# EAGLE design midi-switcher-smt (EAGLE 6.6.0)
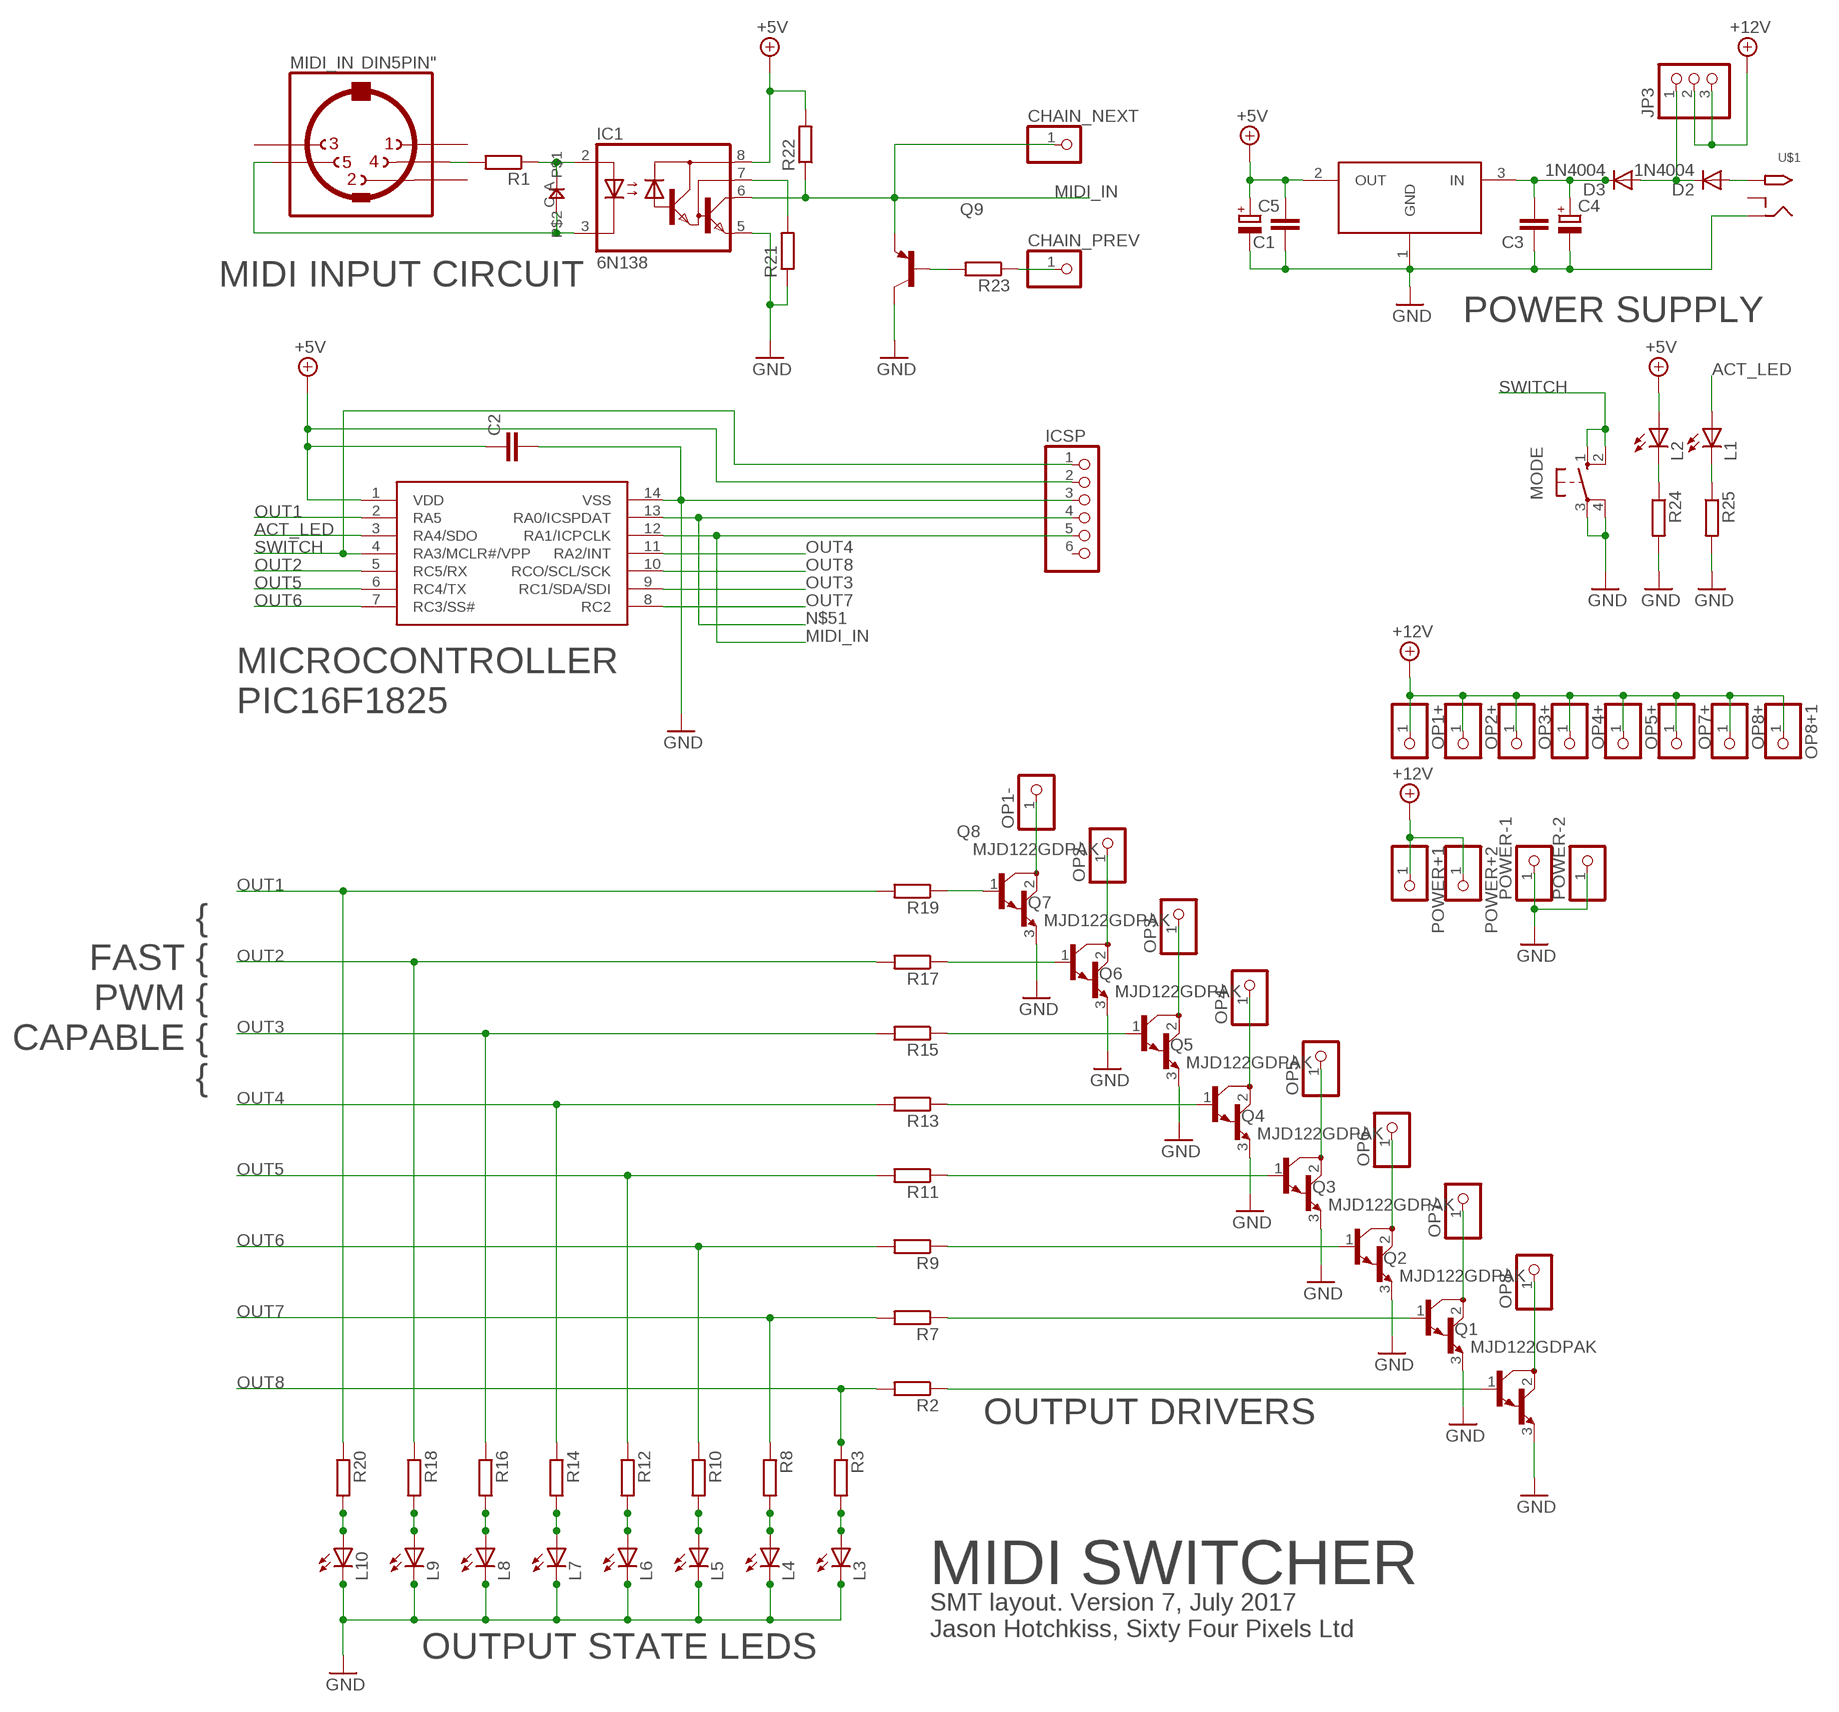
[diagram p0: schematic, sheet 1]

## Parts
C1  C-EUC0805  [C0805]
C2  C-EUC0805  [C0805]
C3  C-EUC0805  [C0805]
C4  CPOL-EUE2.5-7  [E2,5-7]
C5  CPOL-EUE2.5-6  [E2,5-6]
CHAIN_NEXT  PINHD-1X1  [1X01]
CHAIN_PREV  PINHD-1X1  [1X01]
D1  0805DIODE  [0805DIODE]
D2  1N4004  [DO-VERT]
D3  1N4004  [DO-VERT]
IC1  6N138  [DIL08]
IC2  PIC16F1825SO14  [SO14]
IC3  LD1086  [DPACK]
ICSP  HEADER-1X6  [1X06_OVAL]
JP3  PINHD-1X3  [1X03]
L1  LEDCHIP-LED0805  [CHIP-LED0805]
L2  LEDCHIP-LED0805  [CHIP-LED0805]
L3  LEDCHIP-LED0805  [CHIP-LED0805]
L4  LEDCHIP-LED0805  [CHIP-LED0805]
L5  LEDCHIP-LED0805  [CHIP-LED0805]
L6  LEDCHIP-LED0805  [CHIP-LED0805]
L7  LEDCHIP-LED0805  [CHIP-LED0805]
L8  LEDCHIP-LED0805  [CHIP-LED0805]
L9  LEDCHIP-LED0805  [CHIP-LED0805]
L10  LEDCHIP-LED0805  [CHIP-LED0805]
MIDI_IN  DIN5PIN"  [TRUCONN90]
MODE  10-XX  [B3F-10XX]
OP1+  PINHD-1X1  [1X01W]
OP1-  PINHD-1X1  [1X01W]
OP2+  PINHD-1X1  [1X01W]
OP2-  PINHD-1X1  [1X01W]
OP3+  PINHD-1X1  [1X01W]
OP3-  PINHD-1X1  [1X01W]
OP4+  PINHD-1X1  [1X01W]
OP4-  PINHD-1X1  [1X01W]
OP5+  PINHD-1X1  [1X01W]
OP5-  PINHD-1X1  [1X01W]
OP6-  PINHD-1X1  [1X01W]
OP7+  PINHD-1X1  [1X01W]
OP7-  PINHD-1X1  [1X01W]
OP8+  PINHD-1X1  [1X01W]
OP8+1  PINHD-1X1  [1X01W]
OP8-  PINHD-1X1  [1X01W]
POWER+1  PINHD-1X1  [1X01W]
POWER+2  PINHD-1X1  [1X01W]
POWER-1  PINHD-1X1  [1X01W]
POWER-2  PINHD-1X1  [1X01W]
Q1  MJD122GDPAK  [DPACK]
Q2  MJD122GDPAK  [DPACK]
Q3  MJD122GDPAK  [DPACK]
Q4  MJD122GDPAK  [DPACK]
Q5  MJD122GDPAK  [DPACK]
Q6  MJD122GDPAK  [DPACK]
Q7  MJD122GDPAK  [DPACK]
Q8  MJD122GDPAK  [DPACK]
Q9  MMBT3906LT1-PNP-SOT23-BEC  [SOT23-BEC]
R1  R-EU_R0805  [R0805]
R2  R-EU_R0805  [R0805]
R3  R-EU_R0805  [R0805]
R7  R-EU_R0805  [R0805]
R8  R-EU_R0805  [R0805]
R9  R-EU_R0805  [R0805]
R10  R-EU_R0805  [R0805]
R11  R-EU_R0805  [R0805]
R12  R-EU_R0805  [R0805]
R13  R-EU_R0805  [R0805]
R14  R-EU_R0805  [R0805]
R15  R-EU_R0805  [R0805]
R16  R-EU_R0805  [R0805]
R17  R-EU_R0805  [R0805]
R18  R-EU_R0805  [R0805]
R19  R-EU_R0805  [R0805]
R20  R-EU_R0805  [R0805]
R21  R-EU_R0805  [R0805]
R22  R-EU_R0805  [R0805]
R23  R-EU_R0805  [R0805]
R24  R-EU_R0805  [R0805]
R25  R-EU_R0805  [R0805]
U$1  2.1MMJACKTHM  [PJ-102A]

## Nets
+5V: C1.2 C2.1 C5.+ IC1.8(VCC) IC2.1(VDD) IC3.2(OUT) ICSP.2 L2.A R22.2
+12V: JP3.2 JP3.3 OP1+.1 OP2+.1 OP3+.1 OP4+.1 OP5+.1 OP7+.1 OP8+1.1 OP8+.1 POWER+1.1 POWER+2.1
ACT_LED: IC2.3(RA4/SDO) L1.A
GND: C1.1 C2.2 C3.1 C4.- C5.- IC1.5(GND) IC2.14(VSS) IC3.1(GND) ICSP.3 L3.C L4.C L5.C L6.C L7.C L8.C L9.C L10.C MODE.3(P) MODE.4(P1) POWER-1.1 POWER-2.1 Q1.3(E) Q2.3(E) Q3.3(E) Q4.3(E) Q5.3(E) Q6.3(E) Q7.3(E) Q8.3(E) Q9.C R21.1 R24.2 R25.2 U$1.RING
MIDI_IN: CHAIN_NEXT.1 IC1.6(VO) IC2.12(RA1/ICPCLK) ICSP.5 Q9.E R22.1
N$1: D1.C IC1.3(C) MIDI_IN.5
N$2: MIDI_IN.4 R1.2
N$3: D1.A IC1.2(A) R1.1
N$4: IC1.7(VB) R21.2
N$5: L1.C R25.1
N$6: L10.A R20.2
N$7: L9.A R18.2
N$8: Q8.1(B) R19.1
N$9: Q7.1(B) R17.1
N$10: Q6.1(B) R15.1
N$11: Q5.1(B) R13.1
N$12: Q4.1(B) R11.1
N$13: Q3.1(B) R9.1
N$14: Q2.1(B) R7.1
N$15: Q1.1(B) R2.1
N$16: Q9.B R23.2
N$18: CHAIN_PREV.1 R23.1
N$24: L8.A R16.2
N$25: OP1-.1 Q8.2(C)
N$26: OP2-.1 Q7.2(C)
N$27: OP3-.1 Q6.2(C)
N$28: L2.C R24.1
N$29: OP5-.1 Q4.2(C)
N$30: OP6-.1 Q3.2(C)
N$31: OP4-.1 Q5.2(C)
N$33: L7.A R14.2
N$35: L6.A R12.2
N$36: L5.A R10.2
N$37: L4.A R8.2
N$38: L3.A R3.2
N$39: C3.2 C4.+ D3.C IC3.3(IN)
N$42: OP7-.1 Q2.2(C)
N$43: D2.A U$1.TIP
N$47: OP8-.1 Q1.2(C)
N$51: IC2.13(RA0/ICSPDAT) ICSP.4
N$54: D2.C D3.A JP3.1
OUT1: IC2.2(RA5) R19.2 R20.1
OUT2: IC2.5(RC5/RX) R17.2 R18.1
OUT3: IC2.9(RC1/SDA/SDI) R15.2 R16.1
OUT4: IC2.11(RA2/INT) R13.2 R14.1
OUT5: IC2.6(RC4/TX) R11.2 R12.1
OUT6: IC2.7(RC3/SS#) R9.2 R10.1
OUT7: IC2.8(RC2) R7.2 R8.1
OUT8: IC2.10(RCO/SCL/SCK) R2.2 R3.1
SWITCH: IC2.4(RA3/MCLR#/VPP) ICSP.1 MODE.1(S) MODE.2(S1)
Unconnected: ICSP.6 MIDI_IN.1 MIDI_IN.2 MIDI_IN.3 U$1.RING_SW

## Notes on the sheet
- MIDI INPUT CIRCUIT
- POWER SUPPLY
- MICROCONTROLLER 
  PIC16F1825
- {
  FAST {
  PWM {
  CAPABLE {
  {
- OUTPUT DRIVERS
- MIDI SWITCHER
- SMT layout. Version 7, July 2017
  Jason Hotchkiss, Sixty Four Pixels Ltd
- OUTPUT STATE LEDS

## Library data of the parts
C1-C3 = rcl:C-EU: CAPACITOR, European symbol
C4 C5 = rcl:CPOL-EU: POLARIZED CAPACITOR, European symbol
CHAIN_NEXT CHAIN_PREV = adafruit:PINHD-1X1: Pin header 1x1 for 0.1" spacing With round pins
D1 = jasons_stuff:0805DIODE
D2 D3 = jasons_stuff:1N4004: DIODE general purpose rectifier, 1 A
IC1 = optocoupler:6N138: MOTOROLA OPTO COUPLER
IC2 = jasons_stuff:PIC16F1825
IC3 = jason_eagle6:LD1086
ICSP = microbuilder:HEADER-1X6: PIN HEADER
JP3 = pinhead:PINHD-1X3: PIN HEADER
L1-L10 = led:LED: LED OSRAM: - CHIPLED LG R971, LG N971, LY N971, LG Q971, LY Q971, LO R971, LY R971 LH N974, LH R974 LS Q976, LO Q976, LY Q976 LO Q996 - Hyper CHIPLED LW Q18S LB Q993, LB Q99A, LB R99A - SideLED LS A670, LO A670, LY A670, LG A670, LP A670 LB A673, LV A673, LT A673, LW A673 LH A674 LY A675 LS A676, LA A676, LO A676, LY A676, LW A676 LS A679, LY A679, LG A679 - Hyper Micro SIDELED® LS Y876, LA Y876, LO Y876, LY Y876 LT Y87S - SmartLED LW L88C, LW L88S LB L89C, LB L89S, LG L890 LS L89K, LO L89K, LY L89K LS L896, LA L896, LO L896, LY L896 - TOPLED LS T670, LO T670, LY T670, LG T670, LP T670 LSG T670, LSP T670, LSY T670, LOP T670, LYG T670 LG T671, LOG T671, LSG T671 LB T673, LV T673, LT T673, LW T673 LH T674 LS T676, LA T676, LO T676, LY T676, LB T676, LH T676, LSB T676, LW T676 LB T67C, LV T67C, LT T67C, LS T67K, LO T67K, LY T67K, LW E67C LS E67B, LA E67B, LO E67B, LY E67B, LB E67C, LV E67C, LT E67C LW T67C LS T679, LY T679, LG T679 LS T770, LO T770, LY T770, LG T770, LP T770 LB T773, LV T773, LT T773, LW T773 LH T774 LS E675, LA E675, LY E675, LS T675 LS T776, LA T776, LO T776, LY T776, LB T776 LHGB T686 LT T68C, LB T68C - Hyper Mini TOPLED® LB M676 - Mini TOPLED Santana® LG M470 LS M47K, LO M47K, LY M47K Source: http://www.osram.convergy.de LUXEON: - LUMILED® LXK2-PW12-R00, LXK2-PW12-S00, LXK2-PW14-U00, LXK2-PW14-V00 LXK2-PM12-R00, LXK2-PM12-S00, LXK2-PM14-U00 LXK2-PE12-Q00, LXK2-PE12-R00, LXK2-PE12-S00, LXK2-PE14-T00, LXK2-PE14-U00 LXK2-PB12-K00, LXK2-PB12-L00, LXK2-PB12-M00, LXK2-PB14-N00, LXK2-PB14-P00, LXK2-PB14-Q00 LXK2-PR12-L00, LXK2-PR12-M00, LXK2-PR14-Q00, LXK2-PR14-R00 LXK2-PD12-Q00, LXK2-PD12-R00, LXK2-PD12-S00 LXK2-PH12-R00, LXK2-PH12-S00 LXK2-PL12-P00, LXK2-PL12-Q00, LXK2-PL12-R00 Source: www.luxeon.com KINGBRIGHT: KA-3528ASYC Source: www.kingbright.com
MIDI_IN = jasons_stuff:DIN5PIN: Female CONNECTOR 5 pins 90 deg. with shield, horizontal (DIN 41524)
MODE = switch-omron:10-XX: OMRON SWITCH
OP1+ OP1- OP2+ OP2- OP3+ OP3- OP4+ OP4- OP5+ OP5- OP6- OP7+ OP7- OP8+ OP8+1 OP8- POWER+1 POWER+2 POWER-1 POWER-2 = jason_eagle6:PINHD-1X1: PIN HEADER
Q1-Q8 = jason_eagle6:MJD122G: NPN Darlington Transistor
Q9 = transistor:*-PNP-: PNP Transistror
R1-R3 R7-R25 = rcl:R-EU_: RESISTOR, European symbol
U$1 = adafruit:2.1MMJACK: 2.1mm x 5.5mm THM DC jack with internal switch. Digikey part #PJ-102A, 4UCON part #05537 2.1mm x 5.5mm SMT DC jack with internal switch. Digikey part #PJ-002A-SMT, 4UCON part #03267 By microbuilder.eu & adafruit.com

## Board
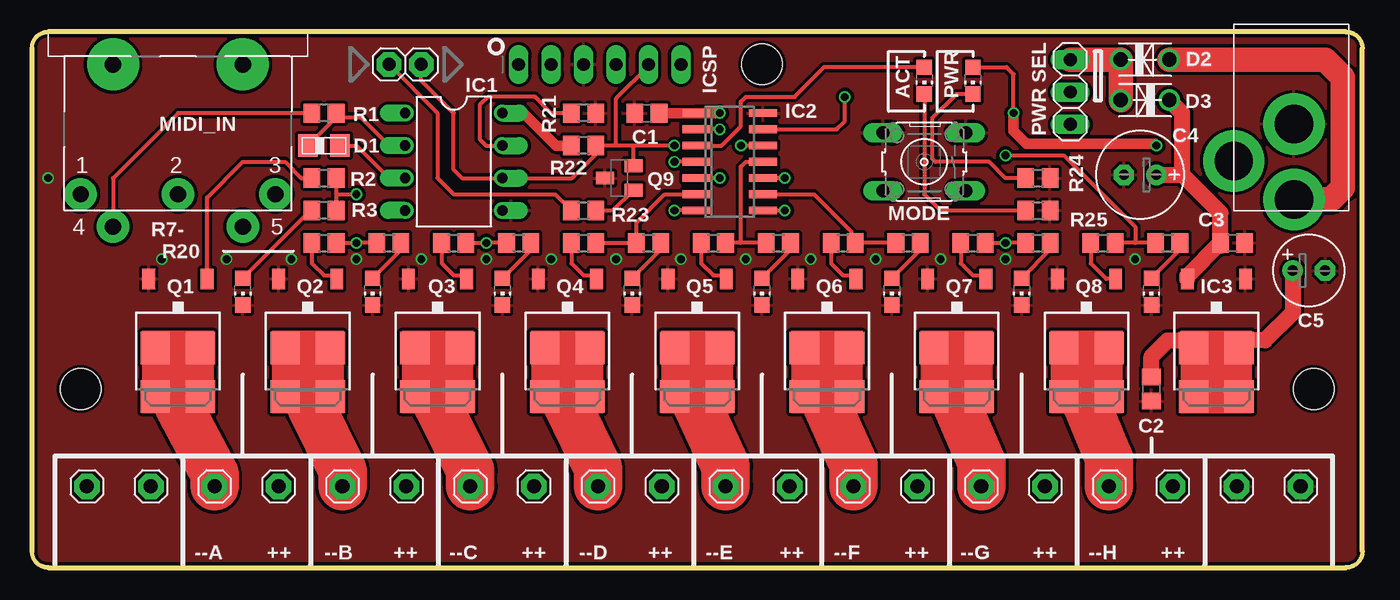
[diagram p1: board, top side]
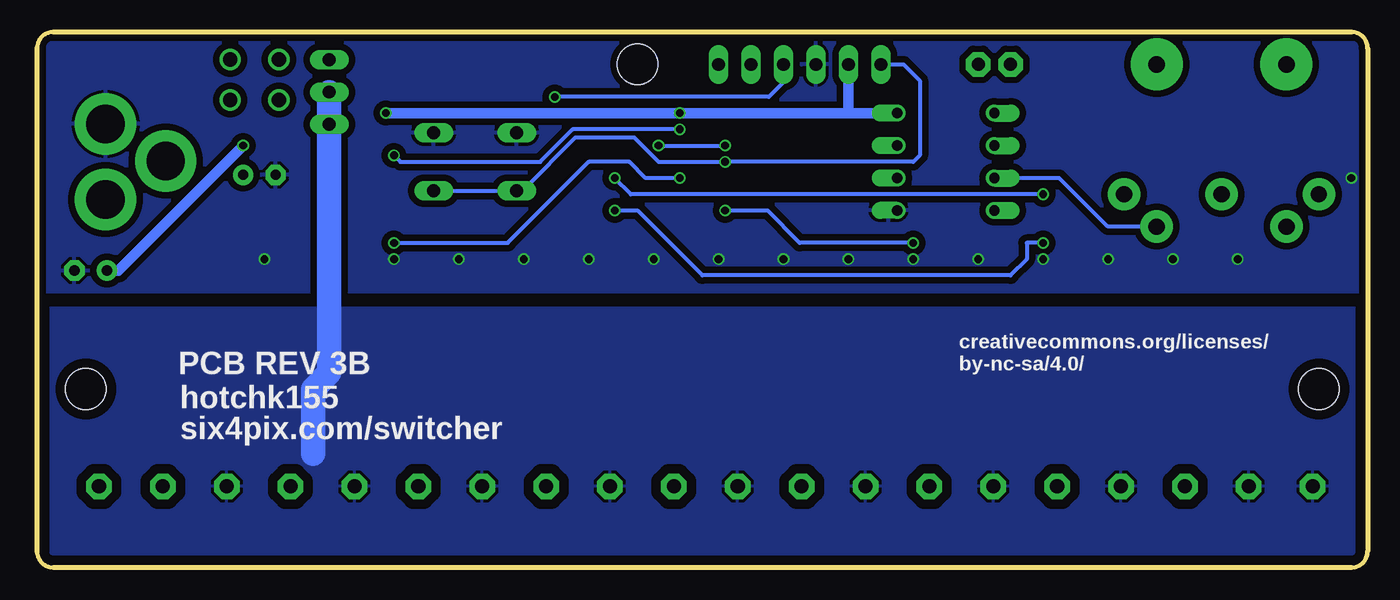
[diagram p2: board, bottom side, seen from below]

Size 104.14 x 41.91 mm. Coordinates in mm from the lower left corner, seen from the top.
Outline: 1.27,0 102.87,0 arc90 104.14,1.27 104.14,40.64 arc90 102.87,41.91 1.27,41.91 arc90 0,40.64 0,1.27 arc90 1.27,0
Copper layers (1*16): Top 0.035mm / dielectric 1.5mm / Bottom 0.035mm
Design rules "ITEADstudio_DRC": minimum track width 6mil, minimum drill 12mil, track to track 6mil, track to pad 6mil, pad to pad 6mil, via to via 6mil, smd to smd 0mil, copper to edge 10mil, drill to drill 10mil, minimum pad ring 10mil, minimum via ring 6mil, stop-mask expansion 2mil, vias tented up to drill 100mil, thermal gap 10mil
Holes 3.2 mm at 3.81,13.97 100.33,13.97 57.15,39.37

### Footprints (pad centres in the part's own frame; a part is rotated, then mirrored left to right if it is on the bottom)
C0805 = smd 1.3 x 1.5: 1 -0.95,0; 2 0.95,0
E2,5-7 = drill 0.813 pad 1.6: + -1.27,0 | drill 0.813 pad 1.6 octagon: - 1.27,0
E2,5-6 = drill 0.813 pad 1.6: + -1.27,0 | drill 0.813 pad 1.6 octagon: - 1.27,0
1X01 = drill 1.016 pad 1.93 octagon: 1 0,0
0805DIODE = smd 1.524 x 1.778: A -1.262,-0.005; C 1.238,-0.005
DO-VERT = drill 1.118: A 2.54,0; C -1.27,0
DIL08 = drill 0.813 offset: 1 -3.81,-3.81; 2 -1.27,-3.81; 3 1.27,-3.81; 4 3.81,-3.81; 5 3.81,3.81; 6 1.27,3.81; 7 -1.27,3.81; 8 -3.81,3.81
SO14 = smd 0.6 x 2.2: 1 -3.81,-2.6; 2 -2.54,-2.6; 3 -1.27,-2.6; 4 0,-2.6; 5 1.27,-2.6; 6 2.54,-2.6; 7 3.81,-2.6; 8 3.81,2.6; 9 2.54,2.6; 10 1.27,2.6; 11 0,2.6; 12 -1.27,2.6; 13 -2.54,2.6; 14 -3.81,2.6
DPACK = smd 1 x 1.6: 1 -2.28,-4.8; 3 2.28,-4.8 | smd 2.286 x 2.54: 2 -1.778,4.405; 4 1.778,4.405; 5 -1.778,0.595; 6 1.778,0.595
1X06_OVAL = drill 1 long: 1 -6.35,0; 2 -3.81,0; 3 -1.27,0; 4 1.27,0; 5 3.81,0; 6 6.35,0
1X03 = drill 1.016 long: 1 -2.54,0; 2 0,0; 3 2.54,0
CHIP-LED0805 = smd 1.2 x 1.2: A 0,-1.05; C 0,1.05
TRUCONN90 = drill 1.27 pad 2.54: 1 7.62,5.08; 2 0,5.08; 3 -7.62,5.08; 4 5.08,7.62; 5 -5.08,7.62 | drill 1.27 pad 4.064: NC -5.08,-5.08; NC@ 5.08,-5.08
B3F-10XX = drill 1.016 long: 1 -3.251,2.261; 2 3.251,2.261; 3 -3.251,-2.261; 4 3.251,-2.261
1X01W = drill 1.1 pad 2 octagon: 1 0,0
SOT23-BEC = smd 1 x 1.4: B -0.95,-1.1; C 0,1.1; E 0.95,-1.1
R0805 = smd 1.3 x 1.5: 1 -0.95,0; 2 0.95,0
PJ-102A = drill 3 pad 4.8: RING 0.1,-3.39; RING_SW -4.6,-6.29; TIP 0.1,-9.29

### Placement (x,y rotation side)
C1  48.13,35.56 0 top
C2  87.63,13.97 270 top
C3  93.98,25.4 180 top
C4  86.74,30.73 180 top
C5  99.95,23.24 0 top
CHAIN_NEXT  30.48,39.37 0 top
CHAIN_PREV  27.94,39.37 0 top
D1  22.86,33.02 0 top
D2  86.49,39.75 0 top
D3  87.76,36.58 180 top
IC1  33.02,31.75 270 top
IC2  54.61,31.75 270 top
IC3  92.71,17.78 180 top
ICSP  44.45,39.37 0 top
JP3  81.28,37.21 270 top
L1  69.85,38.1 180 top
L2  73.66,38.1 180 top
L3  16.51,21.59 180 top
L4  26.67,21.59 180 top
L5  36.83,21.59 180 top
L6  46.99,21.59 180 top
L7  57.15,21.59 180 top
L8  67.31,21.59 180 top
L9  77.47,21.59 180 top
L10  87.63,21.59 180 top
MIDI_IN  11.43,34.29 180 top
MODE  69.85,31.75 180 top
OP1+  19.3,6.35 0 top
OP1-  84.3,6.35 0 top
OP2+  89.3,6.35 0 top
OP2-  74.3,6.35 0 top
OP3+  79.3,6.35 0 top
OP3-  64.3,6.35 0 top
OP4+  69.3,6.35 0 top
OP4-  54.3,6.35 0 top
OP5+  59.3,6.35 0 top
OP5-  44.3,6.35 0 top
OP6-  34.3,6.35 0 top
OP7+  39.3,6.35 0 top
OP7-  24.3,6.35 0 top
OP8+  29.3,6.35 0 top
OP8+1  49.3,6.35 0 top
OP8-  14.3,6.35 0 top
POWER+1  9.3,6.35 0 top
POWER+2  4.3,6.35 0 top
POWER-1  99.3,6.35 0 top
POWER-2  94.3,6.35 0 top
Q1  11.43,17.78 180 top
Q2  21.59,17.78 180 top
Q3  31.75,17.78 180 top
Q4  41.91,17.78 180 top
Q5  52.07,17.78 180 top
Q6  62.23,17.78 180 top
Q7  72.39,17.78 180 top
Q8  82.55,17.78 180 top
Q9  45.97,30.48 90 top
R1  22.86,35.56 180 top
R2  22.86,30.48 0 top
R3  22.86,27.94 180 top
R7  22.86,25.4 0 top
R8  27.94,25.4 0 top
R9  33.02,25.4 0 top
R10  38.1,25.4 0 top
R11  43.18,25.4 0 top
R12  48.26,25.4 0 top
R13  53.34,25.4 0 top
R14  58.42,25.4 0 top
R15  63.5,25.4 0 top
R16  68.58,25.4 0 top
R17  73.66,25.4 0 top
R18  78.74,25.4 0 top
R19  83.82,25.4 0 top
R20  88.9,25.4 0 top
R21  43.18,35.56 180 top
R22  43.18,33.02 180 top
R23  43.18,27.94 0 top
R24  78.74,30.48 0 top
R25  78.74,27.94 0 top
U$1  98.68,38.1 0 top

### Tracks (layer width: path | path; a pad name or v marks a point on that pad's centre or on a via)
+5V  (via drill 0.6)
  Top 0.305: 49.02,35.5 C1.2 | L2.A 76.29,39.15 76.83,38.61 v76.83,35.56
  Top 0.61: v88.01,33.02 87.88,33.15
  Top 0.813: IC1.8 38.48,35.56 41.02,33.02 R22.2 | v53.85,35.56 IC2.1 C1.2 | 92.39,17.46 90.74,17.46 90.42,17.78 | 87.88,33.15 77.85,33.15 76.83,34.16 v76.83,35.56
  Top 1.27: 92.39,17.46 92.71,17.78 | 92.71,17.78 IC3.2 92.71,13.97 91.76,14.92 | C5.+ 98.68,19.94 96.52,17.78 92.71,17.78 | C2.1 87.63,16.51 88.9,17.78 90.42,17.78
  Bottom 0.61: 76.71,35.56 v76.83,35.56
  Bottom 0.813: IC1.8 40.64,35.56 | 40.64,35.56 v53.85,35.56 76.71,35.56 | ICSP.2 40.64,35.56 | C5.+ 97.79,23.24 v88.01,33.02
+12V
  Bottom 1.93: JP3.2 JP3.3 81.28,15.24 82.55,13.97 82.55,8.89
  pour Bottom (isolate 0.762): -2.54,20.32 -2.54,0 106.68,0 106.68,20.32
ACT_LED
  Top 0.305: IC2.3 53.97,33.02 55.5,34.54 55.5,36.45 55.88,36.83 59.69,36.83 62.01,39.15 L1.A
GND  (via drill 0.6)
  other vias: 1.27,30.48 60.96,24.13 66.04,24.13 71.12,24.13 76.2,24.13 50.8,24.13 55.88,24.13 45.72,24.13 40.64,24.13 35.56,24.13 30.48,24.13 25.4,24.13 20.32,24.13 15.24,24.13 10.16,24.13 86.36,24.13
  pour Top (isolate 0.254): -2.54,45.72 -2.54,0 107.95,0 107.95,45.72
  pour Bottom (isolate 0.508): -2.54,44.45 -2.54,21.59 105.41,21.59 105.41,45.72 -2.54,45.72
MIDI_IN  (via drill 0.6)
  Top 0.305: IC2.12 v55.5,33.02 | v50.29,33.02 46.99,33.02 | 46.99,33.02 45.72,33.02 | 45.72,33.02 R22.1 44.07,32.96 44.07,32.26 42.29,30.48 IC1.6 33.66,30.48 33.02,31.11 33.02,35.56 30.48,38.1 CHAIN_NEXT.1 | Q9.E 47.07,32.94 46.99,33.02 | ICSP.5 48.26,39.24 45.72,36.7 45.72,33.02
  Bottom 0.305: v55.5,33.02 v50.29,33.02
N$1
  Top 0.305: D1.C 25.4,33.02 27.94,30.48 IC1.3
  Bottom 0.305: MIDI_IN.5 20.32,26.67 24.13,30.48 IC1.3
N$2
  Top 0.305: R1.2 11.43,35.56 6.35,30.48 MIDI_IN.4
N$3
  Top 0.305: R1.1 23.81,35.23 | 23.81,35.23 D1.A | 23.81,35.23 25.73,35.23 27.94,33.02 IC1.2
N$4
  Top 0.305: R21.2 40.64,35.56 39.37,36.83 35.69,36.83 35.05,36.2 35.05,33.53 35.56,33.02 IC1.7
N$5
  Top 0.305: L1.C 69.85,29.21 71.12,27.94 77.47,27.94 R25.1
N$6
  Top 0.305: R20.2 89.85,24.86 L10.A
N$7
  Top 0.305: R18.2 79.69,24.86 L9.A
N$8
  Top 0.305: Q8.1 84.1,22.58 82.87,23.81 R19.1
N$9
  Top 0.305: R17.1 72.71,23.81 73.66,22.86 74.39,22.86 Q7.1
N$10
  Top 0.305: R15.1 62.55,23.81 63.5,22.86 64.23,22.86 Q6.1
N$11
  Top 0.305: R13.1 52.39,23.81 53.34,22.86 54.07,22.86 Q5.1
N$12
  Top 0.305: R11.1 42.23,23.81 43.18,22.86 43.91,22.86 Q4.1
N$13
  Top 0.305: R9.1 32.07,23.81 33.02,22.86 33.75,22.86 Q3.1
N$14
  Top 0.305: R7.1 21.91,23.81 22.86,22.86 23.59,22.86 Q2.1
N$15
  Top 0.305: Q1.1 13.71,28.95 16.51,31.75 19.81,31.75 21.08,30.48 R2.1
N$16
  Top 0.305: R23.2 45.48,27.94 Q9.B
N$18
  Top 0.305: CHAIN_PREV.1 31.75,35.56 31.75,30.48 33.02,29.21 40.96,29.21 R23.1
N$24
  Top 0.305: R16.2 69.53,24.86 L8.A
N$25
  Top 0.406: Q8.2 82.55,13.38 82.55,12.83
  Top 3.81: OP1-.1 84.3,8.54 82.55,12.83
N$26
  Top 0.406: Q7.2 72.39,13.38 72.39,12.7
  Top 3.81: OP2-.1 74.3,8.25 72.39,12.7
N$27
  Top 0.406: Q6.2 62.23,13.38 62.23,12.7
  Top 3.81: OP3-.1 64.3,8.09 62.23,12.7
N$28
  Top 0.305: R24.1 76.2,30.48 74.93,31.75 70.74,31.75 70.48,32 70.48,35.18 72.36,37.05 L2.C
N$29
  Top 0.406: Q4.2 41.91,13.38 41.91,12.7
  Top 3.81: OP5-.1 44.3,7.77 41.91,12.7
N$30
  Top 0.406: Q3.2 31.75,13.38 31.75,12.7
  Top 3.81: OP6-.1 34.3,7.61 31.75,12.7
N$31
  Top 0.406: Q5.2 52.16,13.38 52.16,12.52
  Top 3.81: OP4-.1 54.3,7.93 52.16,12.52 52.07,12.7
N$33
  Top 0.305: R14.2 59.37,24.86 L7.A
N$35
  Top 0.305: R12.2 49.21,24.86 L6.A
N$36
  Top 0.305: R10.2 39.05,24.86 L5.A
N$37
  Top 0.305: R8.2 28.89,24.86 L4.A
N$38
  Top 0.305: R3.2 21.81,27.94 L3.A
N$39
  Top 1.27: C3.2 93.03,25.18 | IC3.3 90.43,22.8 C3.2 | C3.2 93.03,27.75 90.04,30.73 | 90.04,30.73 90.04,35.56 D3.C | C4.+ 90.04,30.73
N$42
  Top 0.406: Q2.2 21.84,13.38 21.84,12.62
  Top 3.81: 21.84,15.03 21.84,12.62 21.84,12.57 24.3,7.58 OP7-.1
N$43
  Top 1.93: U$1.TIP 101.71,28.81 102.62,29.72 102.62,38.35 101.22,39.75 D2.A
N$47
  Top 0.406: Q1.2 11.59,13.38 11.59,12.41
  Top 3.81: OP8-.1 14.3,7.29 11.59,12.41 11.43,12.7
N$51  (via drill 0.6)
  Top 0.305: IC2.13 62.99,34.29 63.63,34.93 v63.63,36.83
  Bottom 0.305: ICSP.4 45.72,37.97 46.86,36.83 v63.63,36.83
N$54
  Top 1.93: D3.A D2.C JP3.1
OUT1  (via drill 0.6)
  Top 0.305: v53.85,34.29 IC2.2 | R20.1 86.36,25.4 | 86.36,25.4 R19.2 | 86.36,25.4 86.36,26.67 80.77,32.26 v76.2,32.26
  Bottom 0.305: v53.85,34.29 62.23,34.29 64.77,31.75 75.69,31.75 v76.2,32.26
OUT2  (via drill 0.6)
  Top 0.305: R18.1 v76.2,25.4 R17.2 | v53.85,30.48 IC2.5
  Bottom 0.305: v76.2,25.4 67.31,25.4 60.96,31.75 57.78,31.75 56.52,30.48 v53.85,30.48
OUT3
  Top 0.305: R16.1 R15.2 64.13,25.71 64.13,26.29 61.21,29.21 IC2.9
OUT4
  Top 0.305: 55.5,25.4 R13.2 | R14.1 55.5,25.4 | 55.5,25.4 55.5,31.37 55.88,31.75 IC2.11
OUT5
  Top 0.305: R11.2 R12.1 47.31,26.99 49.53,29.21 IC2.6 52.07,29.21
OUT6  (via drill 0.6)
  Top 0.305: R9.2 v35.56,25.4 R10.1 | IC2.7 v50.29,27.94
  Bottom 0.305: v50.29,27.94 46.99,27.94 44.45,25.4 v35.56,25.4
OUT7  (via drill 0.6)
  Top 0.305: R7.2 v25.4,25.4 R8.1 | IC2.8 v58.93,27.94
  Bottom 0.305: v58.93,27.94 57.15,27.94 52.07,22.86 27.94,22.86 26.67,24.13 26.67,25.4 v25.4,25.4
OUT8  (via drill 0.6)
  Top 0.305: R3.1 R2.2 23.81,29.28 23.88,29.21 v25.4,29.21 | v58.93,30.48 IC2.10
  Bottom 0.305: v25.4,29.21 57.66,29.21 v58.93,30.48
SWITCH  (via drill 0.6)
  Top 0.305: IC2.4 v50.29,31.75
  Bottom 0.305: ICSP.1 36.32,39.37 35.05,38.1 35.05,32.26 35.56,31.75 v50.29,31.75 55.5,31.75 57.4,33.66 61.98,33.66 66.04,29.59 | 66.04,29.59 66.5,29.59 MODE.2 | MODE.1 66.14,29.49 66.04,29.59

### Text on the board
tPlace: --A | ++ | --B | ++ | --C | ++ | --D | ++ | --E | ++ | --F | ++ | --G | ++ | --H | ++
bPlace: creativecommons.org/licenses/ / by-nc-sa/4.0/ | PCB REV 3B | hotchk155 | six4pix.com/switcher
tNames: ICSP | ACT | PWR | PWR SEL | MODE | R7- / R20
tDocu: H | A | B | C | D | E | F | G | ~ | ~ | ~ | ~ | POWER | GROUND